# Altium schematic sheet stm32wl_Power.SchDoc
size A4; SheetNumber: 3; SheetTotal: 5; SPICEModelCacheDIGUCLON: <root> / <DocumentId>DIGUCLON</DocumentId> / <CacheFrame Number="0"> / <Model Name="mcp6001" Kind="CKT"> / <Text>.SUBCKT MCP6001 1 2 3 4 5 / *               | | | | | / *               | | | | Output / *               | | | Negative Supply / *               | | Positive Supply / *               | Inverting Input / *               Non-inverting Input / * / ******************************************************************************** / * Software License Agreement                                                   * / *                                                                              * / * The software supplied herewith by Microchip Technology Incorporated (the     * / * "Company") is intended and supplied to you, the Company's customer, for use  * / * soley and exclusively on Microchip products.                                 * / *                                                                              * / * The software is owned by the Company and/or its supplier, and is protected   * / * under applicable copyright laws. All rights are reserved. Any use in         * / * violation of the foregoing restrictions may subject the user to criminal     * / * sanctions under applicable laws, as well as to civil liability for the       * / * breach of the terms and conditions of this license.                          * / *                                                                              * / * THIS SOFTWARE IS PROVIDED IN AN "AS IS" CONDITION. NO WARRANTIES, WHETHER    * / * EXPRESS, IMPLIED OR STATUTORY, INCLUDING, BUT NOT LIMITED TO, IMPLIED        * / * WARRANTIES OF MERCHANTABILITY AND FITNESS FOR A PARTICULAR PURPOSE APPLY TO  * / * THIS SOFTWARE. THE COMPANY SHALL NOT, IN ANY CIRCUMSTANCES, BE LIABLE FOR    * / * SPECIAL, INCIDENTAL OR CONSEQUENTIAL DAMAGES, FOR ANY REASON WHATSOEVER.     * / ******************************************************************************** / * / * Macromodel for the MCP6001/2/4 op amp family: / *   MCP6001, MCP6001R, MCP6001U, MCP6002, MCP6004 / * / * Revision History: / *   REV A: 21-Jun-02, Created model / *   REV B: 16-Jul-02, Improved output stage / *   REV C: 03-Jan-03, Added MCP6001 / *   REV D: 19-Aug-06, Added over temperature, improved output stage, / *                     fixed overdrive recovery time / *   REV E: 27-Jul-07, Updated output impedance for better model stability w/cap load / *   REV F: 09-Jul-12, Added MCP6001R, MCP6001U / * / * Recommendations: / *   Use PSPICE (other simulators may require translation) / *   For a quick, effective design, use a combination of: data sheet / *     specs, bench testing, and simulations with this macromodel / *   For high impedance circuits, set GMIN=100F in .OPTIONS / * / * Supported: / *   Typical performance for temperature range (-40 to 125) degrees Celsius / *   DC, AC, Transient, and Noise analyses. / *   Most specs, including: offsets, DC PSRR, DC CMRR, input impedance, / *     open loop gain, voltage ranges, supply current, ... , etc. / *   Temperature effects for Ibias, Iquiescent, Iout short circuit / *   current, Vsat on both rails, Slew Rate vs. Temp and P.S. / * / * Not Supported: / *   Some Variation in specs vs. Power Supply Voltage / *   Monte Carlo (Vos, Ib), Process variation / *   Distortion (detailed non-linear behavior) / *   Behavior outside normal operating region / * / * Input Stage / V10  3 10 -500M / R10 10 11 6.90K / R11 10 12 6.90K / C11 11 12 0.2p / C12 1  0 6.00P / E12 71 14 POLY(4) 20 0 21 0 26 0 27 0   1.00M 20.1 20.1 1 1 / G12 1 0 62 0 1m / M12 11 14 15 15 NMI L=2.00U W=42.0U / M14 12  2 15 15 NMI L=2.00U W=42.0U / G14 2 0 62 0 1m / C14  2  0 6.00P / I15 15  4 50.0U / V16 16  4 -300M / GD16 16 1 TABLE {V(16,1)} ((-100,-1p)(0,0)(1m,1n)(2m,1m)(3m,1)) / V13  3 13 -300M / GD13 2 13 TABLE {V(2,13)} ((-100,-1p)(0,0)(1m,1n)(2m,1m)(3m,1)) / R70 1 0 20.6T / R71 2 0 20.6T / R72 1 2 20T / I80 1 2 0.5p / * / * Noise, PSRR, and CMRR / I20 21 20 423U / D20 20  0 DN1 / D21  0 21 DN1 / G26  0 26 POLY(1) 3 4   110U -49U / R26 26  0 1 / G27  0 27 POLY(2) 1 0 2 0   -440U 39.7U 39.7U / R27 27  0 1 / * / * Open Loop Gain, Slew Rate / G30  0 30 POLY(1) 12 11   0 1 / R30 30  0 1K / G31  0 31 POLY(1) 3 4 86 5.25 / R31 31  0 1 TC=2.8m / GD31 30 31 TABLE {V(30,31)} ((-11,-1)(-10,-10n)(0,0)(1m,1000)) / G32 32  0 POLY(1) 3 4 113.7 3.5 / R32 32  0 1 TC=2.65m / GD32 30 32 TABLE {V(30,32)} ((-1m,-1000)(0,0)(10,10n)(11,1)) / G33 0 33 30 0 1m / R33 33 0 1k / G34  0 34 33 0 425M / R34  34 0 1K / C34  34 0 74U / G37  0 37 34 0 1m / R37  37 0 1K / C37  37 0 41.6P / G38  0 38 37 0 1m / R38  39 0 1K / L38  38 39 100U / E38  35 0 38 0 1 / G35 33 0 TABLE {V(35,3)} ((-1,-1n)(0,0)(16,1n))(16.1,1)) / G36 33 0 TABLE {V(35,4)} ((-16.1,-1)((-16,-1n)(0,0)(1,1n)) / * / * Output Stage / R80 50 0 100MEG / G50 0 50 57 96 2 / R58 57  96 0.50 / R57 57  0 750 / C58  5  0 2.00P / G57  0 57 POLY(3) 3 0 4 0 35 0   0 0.67M 0.67M 1.5M / GD55 55 57 TABLE {V(55,57)} ((-2m,-1)(-1m,-1m)(0,0)(10,1n)) / GD56 57 56 TABLE {V(57,56)} ((-2m,-1)(-1m,-1m)(0,0)(10,1n)) / E55 55  0 POLY(2) 3 0 51 0 -0.7m 1 -40.0M / E56 56  0 POLY(2) 4 0 52 0 1.2m 1 -37.0M / R51 51 0 1k / R52 52 0 1k / GD51 50 51 TABLE {V(50,51)} ((-10,-1n)(0,0)(1m,1m)(2m,1)) / GD52 50 52 TABLE {V(50,52)} ((-2m,-1)(-1m,-1m)(0,0)(10,1n)) / G53  3  0 POLY(1) 51 0  -49U 1M / G54  0  4 POLY(1) 52 0  -49U -1M / * / * Current Limit / G99 96 5 99 0 1 / R98 0 98 1 TC=-2.8M,2.63U / G97 0 98 TABLE { V(96,5) } ((-11.0,-10.0M)(-1.00M,-9.9M)(0,0)(1.00M,9.9M)(11.0,10.0M)) / E97 99 0 VALUE { V(98)*((V(3)-V(4))*359M + 310M)} / D98 4 5 DESD / D99 5 3 DESD / * / * Temperature / Voltage Sensitive IQuiscent / R61 0 61 100 TC 3.11M 4.51U / G61 3 4 61 0 1 / G60 0 61 TABLE {V(3, 4)} / + ((0,0)(900M,0.0106U)(1.00,0.20U)(1.3,0.63U) / + (1.5,0.66U)(1.6,1.06U)(5.5,1.10U)) / * / * Temp Sensitive offset voltage / I73 0 70 DC 1uA / R74 0 70 1 TC=2 / E75 1 71 70 0 1 / * / * Temp Sensistive IBias / I62 0 62 DC 1uA / R62 0 62 REXP 58.2u / * Voltage on R62 used for G12, G14 in input stage / * / * Models / .MODEL NMI NMOS / .MODEL DESD  D   N=1 IS=1.00E-15 / .MODEL DL  D   N=1 IS=1F / .MODEL DN1 D   IS=1P KF=146E-18 AF=1 / .MODEL REXP RES TCE=10.1 / .ENDS MCP6001</Text> / </Model> / </CacheFrame> / </root>
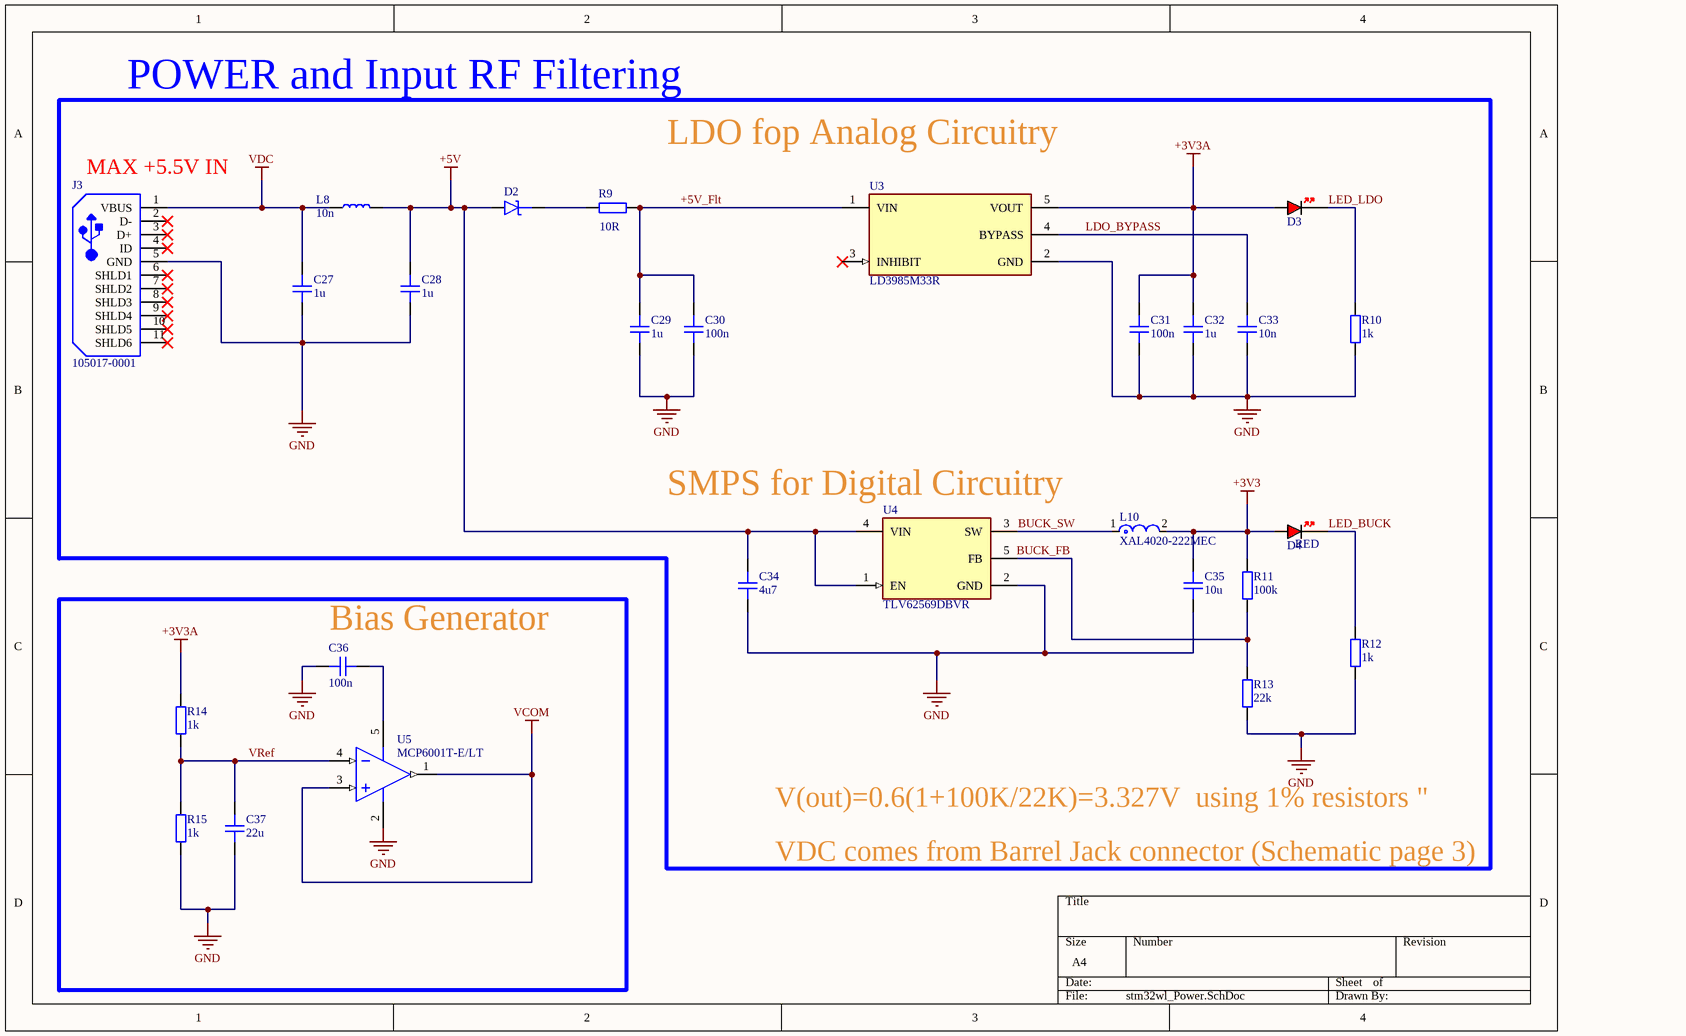
[diagram p0: stm32wl_Power.SchDoc]

## Parts
C27  1u  [CAP_0603]
C28  1u  [CAP_0603]
C29  1u  [CAP_0603]
C30  100n  [CAP_0603]
C31  100n  [CAP_0603]
C32  1u  [CAP_0603]
C33  10n  [CAP_0603]
C34  4u7  [CAP_0603]
C35  10u  [CAP_0603]
C36  100n  [CAP_0402]
C37  22u  [CAP_0603]
D2  D_SCHOTTKY_SOD_323  [SOD-323]  (value not drawn)
D3  RED  [LED_0402_RED]  (value not drawn)
D4  RED  [LED_0402_RED]
J3  105017-0001  [USB-MICRO-B_V]
L8  10n  [IND_0603]
L10  XAL4020-222MEC  [FP-XAL4020-MFG]
R9  10R  [RES_0603]
R10  1k  [RES_0402]
R11  100k  [RES_0402]
R12  1k  [RES_0402]
R13  22k  [RES_0402]
R14  1k  [RES_0402]
R15  1k  [RES_0402]
U3  LD3985M33R  [FP-SOT23-5L-7049676-IPC_C]
U4  TLV62569DBVR  [FP-DBV0005A-MFG]
U5  MCP6001T-E/LT  [SC70-LT5_L]

## Blocks framed on the sheet
POWER and Input RF Filtering: C27-C35 D2-D4 J3 L8 L10 R9-R13 U3 U4
Bias Generator: C36 C37 R14 R15 U5

## Nets
+3V3: C35.2 D4.A L10.2 R11.2
+3V3A: C31.2 C32.2 D3.A R14.2 U3.5(VOUT)
+5V: C28.2 C34.2 D2.A L8.2 U4.1(EN) U4.4(VIN)
GND: C27.1 C28.1 C29.1 C30.1 C31.1 C32.1 C33.1 C34.1 C35.1 C36.2 C37.1 J3.5(GND) R10.1 R12.1 R13.1 R15.1 U3.2(GND) U4.2(GND) U5.2(VSS)
VCOM: U5.1(VOUT) U5.3(VIN+)
VDC: C27.2 J3.1(VBUS) L8.1
+5V_Flt: C29.2 C30.2 R9.2 U3.1(VIN)
BUCK_FB: R11.1 R13.2 U4.5(FB)
BUCK_SW: L10.1 U4.3(SW)
LDO_BYPASS: C33.2 U3.4(BYPASS)
LED_BUCK: D4.K R12.2
LED_LDO: D3.K R10.2
VRef: C37.2 R14.1 R15.2 U5.4(VIN-)
NetC36_1: C36.1 U5.5(VDD)
NetD2_K: D2.K R9.1

Not connected (* = marked no-connect by the designer): J3 2(D-)* 3(D+)* 4(ID)* 6(SHLD1)* 7(SHLD2)* 8(SHLD3)* 9(SHLD4)* 10(SHLD5)* 11(SHLD6)*; U3 3(INHIBIT)*

## Notes on the sheet
- (near J3) MAX +5.5V IN
- LDO fop Analog Circuitry
- SMPS for Digital Circuitry
- V(out)=0.6(1+100K/22K)=3.327V  using 1% resistors "
- VDC comes from Barrel Jack connector (Schematic page 3)

## Library data of the parts
C27-C35 C37 = CAP_0603_16V: Capacitor SMD 0603 16V
C36 = CAP_0402_16V: Capacitor SMD 0402 16V
D2 = D_SCHOTTKY_SOD_323: Diode Schottky SMD SOD-323
D3 D4 = LED_0402_RED: LED 0402 RED SMD
J3 = CMP-2000-05827-1: Micro-USB B Receptacle, Right Angle, Bottom Mount, Surface Mount, with Solder Tabs, -30 to 85 degC, 5-Pin USB, RoHS, Tape and Reel; Manufacturer: Molex; Featured Product: Micro-USBConnectorsUSBConnectors; Other Names: WM1399DKR; Package Version: Rev. F, 12/2012; Number of Contacts: 5; Connector Type: USB-microB; Catalog Drawings: 1050170001; 3D Model: 105017-0001.stp; Mating Products: WM17145-ND-CABLEMICROUSBBTOSTDA1.0MWM17147-ND-CABLEMICROUSBBTOSTDA2.0MWM17146-ND-CABLEMICROUSBBTOSTDA1.5M; PCN Assembly/Origin: ResinSupplier21/Oct/2015; Voltage - Max: 30V; Online Catalog: Molex-MicroUSB; Manufacturer URL: http://www.molex.com/; Package Description: 5-Leads USB, Micro B, Body 7.5 x 5 mm, Pitch 0.65 mm; Datasheet URL: http://www.molex.com/elqNow/elqRedir.htm?ref=http://www.molex.com/webdocs/datasheets/pdf/en-us/1050170001_IO_CONNECTORS.pdf; Ingress Protection: -; Datasheet Version: 03/2016; Mounting Type: BoardCutout,SurfaceMount,RightAngle; Circuits: 5; Standard Package: 1; Package Reference: MICRO-B; Package URL: http://www.molex.com/pdm_docs/sd/1050170001_sd.pdf; Category: Connectors,Interconnects; Series: -; RoHS Information: 1050170001CertofCompliance; Features: Shielded,SolderRetention; Family: USB,DVI,HDMIConnectors; Specifications: -; Gender: Receptacle; Packaging: Digi-Reel®; Mounting Technology: SurfaceMount
L8 = IND_0603: Inductor SMD 0603
L10 = CMP-11268-000134-1: Fixed Inductors 2.2uH Shld 20% 5.5A 38.7mOhms AECQ2; Saturation Current: 5.6A; Core Material: Composite; DC Resistance (DCR): 38.7mR; Self Resonant Frequency: 52MHz; Test Frequency: 100kHz; Shielding: Shielded; Length: 4.3mm; Tolerance: 20%; Packaging: Tape and Reel; Height: 2.1mm; Mount: Surface Mount; Termination: SMD/SMT; Lead Free: Contains Lead; Package Quantity: 1000; Inductance: 2.2uH; Series: XAL4020; Min Operating Temperature: -40°C; Max DC Current: 5.5A; Max Operating Temperature: 125°C; Case/Package: SMD/SMT; Inductance Tolerance: 20%; RMS Current (Irms): 5.5A; Width: 4.3mm; RoHS Compliant: Yes
R9 = RES_0603: Resistor SMD 0603
R10-R15 = RES_0402: Resistor SMD 0402
U3 = CMP-0244-00328-3: NexarPartId: 526998; Min Output Voltage: 3.3V; Min Input Voltage: 2.5V; Max Junction Temperature (Tj): 125°C; Min Current Limit: 300mA; Input Bias Current: 85µA; Max Supply Voltage: 6V; Quiescent Current: 150µA; Max Output Current: 150mA; Number of Channels: 1; Output Type: Fixed; Output Voltage Accuracy: 2%; Polarity: Positive; Dropout Voltage: 60mV; Width: 1.75mm; Height: 1.3mm; Lifecycle Status: Production; Case/Package: SOT-23; RoHS: Compliant; Output Current: 150mA; Radiation Hardening: No; Number of Regulators: 1; Max Operating Temperature: 125°C; Output Voltage: 3.3V; Min Supply Voltage: 2.5V; Min Operating Temperature: -40°C; Accuracy: 2%; Number of Outputs: 1; Number of Pins: 5; Packaging: Cut Tape (CT); Lead Free: Lead Free; Schedule B: 8542390000, 8542390000|8542390000, 8542390000|8542390000|8542390000, 8542390000|8542390000|8542390000|8542390000; Mount: Surface Mount; Max Input Voltage: 6V; Length: 3mm
U4 = CMP-04918-000387-1: IC REG BUCK ADJ 2A SOT23-5; Output Configuration: Positive; Min Output Voltage: 600mV; Max Output Voltage: 5.5V; Switching Frequency: 1.5MHz; Output Type: Adjustable; Synchronous Rectifier: Yes; Min Input Voltage: 2.5V; Output Current: 2A; Mount: Surface Mount; Min Operating Temperature: -40°C; Max Operating Temperature: 125°C; RoHS Compliant: Yes; Max Input Voltage: 5.5V; Case/Package: SOT-23-5; Packaging: Cut Tape
U5 = CMP-0187-00463-3: None; Unity Gain Bandwidth Product: 1MHz; Output Current: 23mA; Input Offset Voltage-Max: 4.5mV; Supply Current: 100uA; Power Supply Rejection Ratio (PSRR): 86dB; Amplifier Type: GENERAL PURPOSE; Slew Rate: 0.6V/µs; Number of Amplifiers: 1; Min Supply Voltage: 1.8V; Voltage Gain: 112dB; Common Mode Rejection Ratio: 60dB; Input Bias Current: 1pA; Max Supply Voltage: 6V; Operating Supply Voltage: 5.5V; Min Operating Temperature: -40°C; Width: 1.35mm; RoHS Compliant: Yes; Number of Pins: 5; Input Offset Voltage (Vos): 4.5mV; Packaging: Tape and Reel; Lead Free: Lead Free; Nominal Supply Current: 100uA; Technology: CMOS; Contact Plating: Tin; Height: 1mm; Mount: Surface Mount; Radiation Hardening: No; Gain Bandwidth Product: 1MHz; Number of Channels: 1; Bandwidth: 1MHz; Case/Package: SC; REACH SVHC: No SVHC; Number of Circuits: 1; Number of Elements: 1; Package Quantity: 3000; Length: 2.25mm; Slew Rate-Nom: 0.6V/µs; Max Operating Temperature: 125°C